# Altium schematic sheet DAC7828_Voltage-Reg-Ref.SchDoc
size A3; Organization: University of Amsterdam; Address1: Technology Centre; DocumentNumber: 1; SheetNumber: 2; SheetTotal: 4
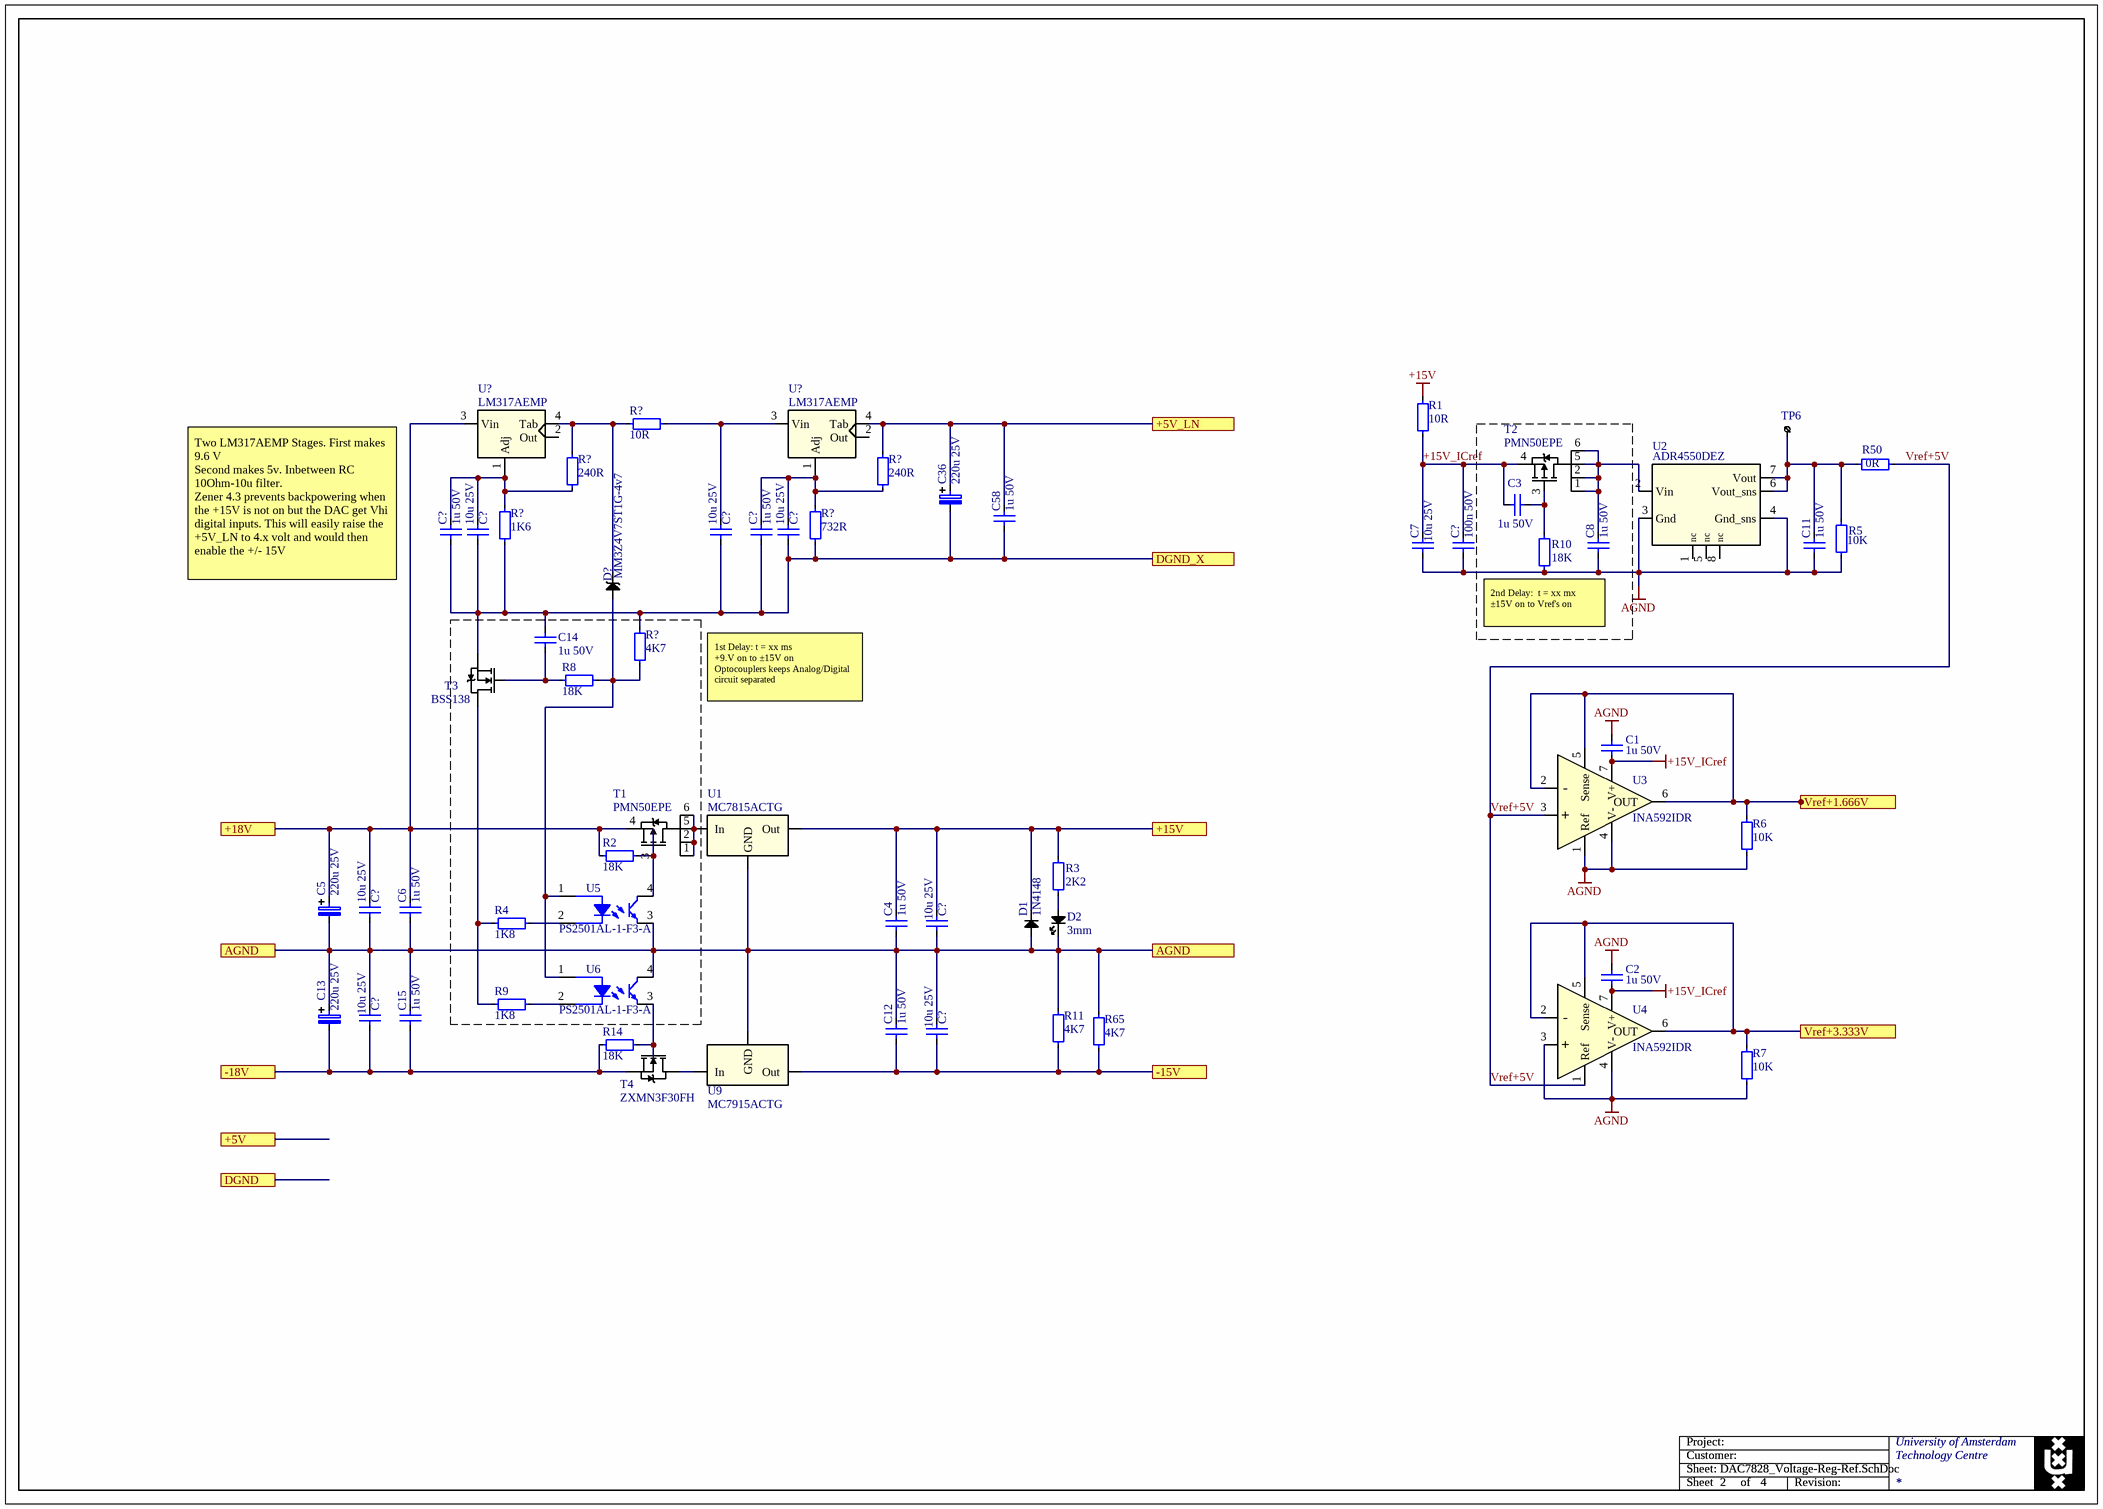
[diagram p0: DAC7828_Voltage-Reg-Ref.SchDoc]

## Parts
(Parts that share a designator on the sheet are numbered #1, #2 ... from top to bottom, then left to right.)
C1  1u 50V  [cap0603MD]
C2  1u 50V  [cap0603MD]
C3  1u 50V  [cap0603MD]
C4  1u 50V  [cap0603MD]
C5  220u 25V  [capAluSmd_d8H10mm]
C6  1u 50V  [cap0603MD]
C7  10u 25V  [cap0805MD]
C8  1u 50V  [cap0603MD]
C11  1u 50V  [cap0603MD]
C12  1u 50V  [cap0603MD]
C13  220u 25V  [capAluSmd_d8H10mm]
C14  1u 50V  [cap0603MD]
C15  1u 50V  [cap0603MD]
C36  220u 25V  [capAluSmd_d8H10mm]
C58  1u 50V  [cap0603MD]
C?#1  1u 50V  [cap0603MD]
C?#2  1u 50V  [cap0603MD]
C?#3  10u 25V  [cap0805MD]
C?#4  10u 25V  [cap0805MD]
C?#5  10u 25V  [cap0805MD]
C?#6  100n 50V  [cap0603MD]
C?#7  10u 25V  [cap0805MD]
C?#8  10u 25V  [cap0805MD]
C?#9  10u 25V  [cap0805MD]
C?#10  10u 25V  [cap0805MD]
D1  1N4148  [SOD2513X100N]
D2  3mm  [LED_3MM_PCB_EDGE_SMD]
D?  MM3Z4V7ST1G-4v7  [SOD-323-2]
R1  10R  [res0603MD]
R2  18K  [res0603MD]
R3  2K2  [res0603MD]
R4  1K8  [res0603MD]
R5  10K  [res0603MD]
R6  10K  [res0603MD]
R7  10K  [res0603MD]
R8  18K  [res0603MD]
R9  1K8  [res0603MD]
R10  18K  [res0603MD]
R11  4K7  [res0603MD]
R14  18K  [res0603MD]
R50  0R  [res0603MD]
R65  4K7  [res0603MD]
R?#1  10R  [res0603MD]
R?#2  240R  [res0603MD]
R?#3  240R  [res0603MD]
R?#4  1K6  [res0603MD]
R?#5  732R  [res0603MD]
R?#6  4K7  [res0603MD]
T1  PMN50EPE  [TSOP95P280X110-6N]
T2  PMN50EPE  [TSOP95P280X110-6N]
T3  BSS138  [SOT95P230X110-3N]
T4  ZXMN3F30FH  [SOT95P230X110-3N]
TP6  Testpoint  [Testpoint_1mm]  (value not drawn)  (no BOM)
U1  MC7815ACTG  [TO220-3_FLAT]
U2  ADR4550DEZ  [LCCS127P503X450X221-8M]
U3  INA592IDR  [SOIC127P600X175-8N]
U4  INA592IDR  [SOIC127P600X175-8N]
U5  PS2501AL-1-F3-A  [SOP254P960X380-4N]
U6  PS2501AL-1-F3-A  [SOP254P960X380-4N]
U9  MC7915ACTG  [TO220-3_FLAT]
U?#1  LM317AEMP  [SOT-223-3P]
U?#2  LM317AEMP  [SOT-223-3P]

## Ports
+5V, +5V_LN, +15V, +18V, -15V, -18V, AGND, DGND, DGND_X, Vref+1.666V, Vref+3.333V

## Nets
+15V: R1.2
+15V_ICref: C1.1 C2.1 C3.1 C7.2 C?#6.2 R1.1 T2.4(S) U3.7(V+) U4.7(V+)
AGND: C1.2 C2.2 C7.1 C8.2 C11.2 C?#6.1 R5.1 R6.1 R7.1 R10.1 U2.3(Gnd) U2.4(Gnd_sns) U3.1(Ref) U3.4(V-) U4.3(+) U4.4(V-)
+5V_LN: C36.P C58.1 R?#3.2 U?#2.4(Tab) ; port +5V_LN
+15V: C4.1 C?#8.2 D1.1 R3.2 U1.3(Out) ; port +15V  [a separate net that carries the same name]
+18V: C5.P C6.1 C?#7.2 R2.1 T1.4(S) U?#1.3(Vin) ; port +18V
-15V: C12.2 C?#10.1 R11.1 R65.1 U9.3(Out) ; port -15V
-18V: C13.N C15.2 C?#9.1 R14.1 T4.2(S) ; port -18V
AGND: C4.2 C5.N C6.2 C12.1 C13.P C15.1 C?#7.1 C?#8.1 C?#9.2 C?#10.2 D1.2 D2.1 R11.2 R65.2 U1.2(GND) U5.3 U6.4 U9.1(GND) ; port AGND  [a separate net that carries the same name]
DGND_X: C14.1 C36.N C58.2 C?#1.2 C?#2.2 C?#3.1 C?#4.1 C?#5.1 R?#4.1 R?#5.1 R?#6.2 T3.2(S) ; port DGND_X
Vref+1.666V: R6.2 U3.2(-) U3.5(Sense) U3.6(OUT) ; port Vref+1.666V
Vref+3.333V: R7.2 U4.2(-) U4.5(Sense) U4.6(OUT) ; port Vref+3.333V
Vref+5V: R50.2 U3.3(+) U4.1(Ref)
NetC3_2: C3.2 R10.2 T2.3(G)
NetC8_1: C8.1 T2.1(D) T2.2(D) T2.5(D) T2.6(D) U2.2(Vin)
NetC11_1: C11.1 R5.2 R50.1 TP6.1 U2.6(Vout_sns) U2.7(Vout)
NetC14_2: C14.2 R8.2 T3.1(G)
NetC?#1_1: C?#1.1 C?#3.2 R?#2.1 R?#4.2 U?#1.1(Adj)
NetC?#2_1: C?#2.1 C?#5.2 R?#3.1 R?#5.2 U?#2.1(Adj)
NetC?#4_2: C?#4.2 R?#1.2 U?#2.3(Vin)
NetD2_2: D2.2 R3.1
NetD?_A: D?.A R8.1 R?#6.1 U5.1 U6.1
NetD?_C: D?.C R?#1.1 R?#2.2 U?#1.4(Tab)
NetR2_2: R2.2 T1.3(G) U5.4
NetR4_1: R4.1 R9.1 T3.3(D)
NetR4_2: R4.2 U5.2
NetR9_2: R9.2 U6.2
NetR14_2: R14.2 T4.1(G) U6.3
NetT1_1: T1.1(D) T1.2(D) T1.5(D) T1.6(D) U1.1(In)
NetT4_3: T4.3(D) U9.2(In)

Not connected (* = marked no-connect by the designer): U2 1(nc) 5(nc) 8(nc); U?#1 2(Out); U?#2 2(Out)

## Notes on the sheet
- Two LM317AEMP Stages. First makes 9.6 V
  Second makes 5v. Inbetween RC 10Ohm-10u filter.
  Zener 4.3 prevents backpowering when the +15V is not on but the DAC get Vhi digital inputs. This will easily raise the +5V_LN to 4.x volt and would then enable the +/- 15V
- (near R10) 2nd Delay:  t = xx mx
  ±15V on to Vref's on
- 1st Delay: t = xx ms
  +9.V on to ±15V on
  Optocouplers keeps Analog/Digital circuit separated
- Project:
- Customer:
- Sheet
- Sheet:
- of
- Revision:

## Library data of the parts
C1-C4 C6 C8 C11 C12 C14 C15 C58 C?#1 C?#2 = Cap0603MD_1u_X5R_50V_10%: id: 123; Precision: 10%; Type: X5R; Author: Twe; Partname: Cap0603MD_1u_X5R_50V_10%; MyComment: 1u 50V; Capacitance: 1u; Supplier 1: Farnell; Supplier Part Number 1: 3013383; CreationDate: 23-Mar-20; Checked by: Unchecked; Voltage: 50V
C5 C13 C36 = EDK227M025A9MAA: Cap Alu SMD d8h11, ±20%; Manufacturer: Kemet; id: 37; Author: EB; Partname: EDK227M025A9MAA; MyComment: 220u 25V; Capacitance: 220u; Precision: 20%; ManufacturerCode: EDK227M025A9MAA; Supplier 1: Digi-Key; Supplier Part Number 1: 399-18129-1-ND; CreationDate: 06-Jul-22 14:38:19; Checked by: Unchecked; Voltage: 25V
C7 C?#3-C?#5 C?#7-C?#10 = Cap0805MD_10u_X5R_25V_10%: id: 146; Precision: 10%; Type: 5XR; Author: EB; Partname: Cap0805MD_10u_X5R_25V_10%; MyComment: 10u 25V; Capacitance: 10u; Supplier 1: Farnell; Supplier Part Number 1: 1735530; CreationDate: 31-Mar-16 14:12:18; Checked by: Unchecked; Voltage: 25V
C?#6 = Cap0603MD_100n_X7R_50V_10%: id: 12; Precision: 10%; Type: X7R; Author: TvR; Partname: Cap0603MD_100n_X7R_50V_10%; MyComment: 100n 50V; Capacitance: 100n; Supplier 1: Farnell; Supplier Part Number 1: 2581046; CreationDate: 31-Mar-16 14:01:33; Checked by: Unchecked; Voltage: 50V
D1 = 1N4148WS: Small Signal Diode, Single, 100 V, 150 mA, 1 V, 4 ns, 350 mA; Manufacturer: Multicomp; id: 15; Type: General Purpose; Author: Twe; Partname: 1N4148WS; MyComment: 1N4148; ManufacturerCode: 1N4148WS; Supplier 1: Farnell; Supplier Part Number 1: 1466524; CreationDate: 26-Aug-16 13:43:40; Checked by: PCB
D2 = LED_3mm_PcbEdgeSmd: Generic 3mm LED Footprint PCB Edge SMD Pads; id: 40; Author: EB; Partname: LED_3mm_PcbEdgeSmd; MyComment: 3mm; Type: LED; Supplier 1: Farnell; CreationDate: 26-May-16 08:35:38; Checked by: Unchecked
D? = MM3Z4V7ST1G: Zener 4v7, 300 mW, SOD−323; Manufacturer: On Semiconductor; id: 41; Author: EB; Partname: MM3Z4V7ST1G; MyComment: MM3Z4V7ST1G-4v7; Type: Zener; ManufacturerCode: MM3Z4V7ST1G; Supplier 1: Farnell; Supplier Part Number 1: 2463512; CreationDate: 13-Oct-22 10:49:01; Checked by: Unchecked
R1 R?#1 = Res0603MD_10R_1%: id: 265; Precision: 1%; Author: Twe; Partname: Res0603MD_10R_1%; MyComment: 10R; Resistance: 10R; Supplier 1: Farnell; Supplier Part Number 1: 2447233; CreationDate: 30-Mar-16 10:33:13; Checked by: Unchecked
R2 R8 R10 R14 = Res0603MD_18K_1%: id: 342; Precision: 1%; Author: Twe; Partname: Res0603MD_18K_1%; MyComment: 18K; Resistance: 18K; Supplier 1: Farnell; Supplier Part Number 1: 9330720; CreationDate: 30-Mar-16 10:33:13; Checked by: Unchecked
R3 = Res0603MD_2K2_1%: id: 320; Precision: 1%; Author: Twe; Partname: Res0603MD_2K2_1%; MyComment: 2K2; Resistance: 2K2; Supplier 1: Farnell; Supplier Part Number 1: 9330810; CreationDate: 30-Mar-16 10:33:13; Checked by: Unchecked
R4 R9 = Res0603MD_1K8_1%: id: 318; Precision: 1%; Author: Twe; Partname: Res0603MD_1K8_1%; MyComment: 1K8; Resistance: 1K8; Supplier 1: Farnell; Supplier Part Number 1: 9330712; CreationDate: 30-Mar-16 10:33:13; Checked by: Unchecked
R5-R7 = Res0603MD_10K_1%: id: 336; Precision: 1%; Author: TvR; Partname: Res0603MD_10K_1%; MyComment: 10K; Resistance: 10K; Supplier 1: Farnell; Supplier Part Number 1: 2446547; CreationDate: 30-Mar-16 10:33:13; Checked by: Unchecked
R11 R65 R?#6 = Res0603MD_4K7_1%: id: 328; Precision: 1%; Author: Twe; Partname: Res0603MD_4K7_1%; MyComment: 4K7; Resistance: 4K7; Supplier 1: Farnell; Supplier Part Number 1: 2447385; CreationDate: 30-Mar-16 10:33:13; Checked by: Unchecked
R50 = Res0603MD_0R_1%: id: 264; Precision: 1%; Author: Twe; Partname: Res0603MD_0R_1%; MyComment: 0R; Resistance: 0R; Supplier 1: Farnell; Supplier Part Number 1: 2447743; CreationDate: 30-Mar-16 10:33:13; Checked by: Unchecked
R?#2 R?#3 = Res0603MD_240R_1%: id: 297; Precision: 1%; Author: Twe; Partname: Res0603MD_240R_1%; MyComment: 240R; Resistance: 240R; Supplier 1: Farnell; Supplier Part Number 1: 9330860; CreationDate: 30-Mar-16 10:33:13; Checked by: Unchecked
R?#4 = Res0603MD_1K6_1%: id: 317; Precision: 1%; Author: Twe; Partname: Res0603MD_1K6_1%; MyComment: 1K6; Resistance: 1K6; Supplier 1: Farnell; Supplier Part Number 1: 9330666; CreationDate: 30-Mar-16 10:33:13; Checked by: Unchecked
R?#5 = Res0603MD_7320R_1%: id: 537; Precision: 1%; Author: Twe; Partname: Res0603MD_7320R_1%; MyComment: 732R; Resistance: 732R; Supplier 1: Farnell; Supplier Part Number 1: 9331506; CreationDate: 30-Mar-16 10:33:13; Checked by: Unchecked
T1 T2 = PMN50EPE: P Channel, MOSFET, -30 V, -6A, 0.045 ohm, SOT457; Manufacturer: NEXPERIA; id: 27; Type: MOSFET P; Author: EB; Partname: PMN50EPE; MyComment: PMN50EPE; ManufacturerCode: PMN50EPE; Supplier 1: Farnell; Supplier Part Number 1: 2900296; CreationDate: 08-Jul-22 12:04:36; Checked by: Unchecked
T3 = BSS138: N-Channel Logic Level Enhancement, 3R5; Manufacturer: ON Semi; id: 20; Type: MOSFET EN; Author: TvR; Partname: BSS138; MyComment: BSS138; ManufacturerCode: BSS138; Supplier 1: Farnell; Supplier Part Number 1: 9845330; CreationDate: 20-May-19 16:27:00; Checked by: Unchecked
T4 = ZXMN3F30FH: MOSFET Transistor, N Channel, 4.6 A, 30 V, 65 mohm, 4.5Vgs; Manufacturer: ZETEX; id: 26; Type: MOSFET N; Author: EB; Partname: ZXMN3F30FH; MyComment: ZXMN3F30FH; ManufacturerCode: ZXMN3F30FH; Supplier 1: Farnell; Supplier Part Number 1: 1583667; CreationDate: 07-Jul-22 12:16:34; Checked by: Unchecked
TP6 = Testpoint_1mm: Testpoint pad 1mm; id: 2; Author: Twe; Partname: Testpoint_1mm; MyComment: Testpoint; Type: Testpoint; Supplier 1: Farnell; CreationDate: 31-Mar-16 13:33:27; Checked by: PCB
U1 = MC7815ACTG_Flat: Linear Voltage Regulator,Positive, Fixed, 35V In, 15V And 1A Out; Manufacturer: OnSEMI; id: 191; Author: EB; Partname: MC7815ACTG_Flat; MyComment: MC7815ACTG; Type: Power; ManufacturerCode: MC7815ACTG; Supplier 1: Digi-Key; CreationDate: 06-Jul-22 13:15:49; Checked by: Unchecked
U2 = ADR4550DEZ: Ultralow Noise, High Accuracy / Voltage References; Manufacturer: Analog Devices; id: 187; Author: EB; Partname: ADR4550DEZ; MyComment: ADR4550DEZ; Type: Voltage Reference; ManufacturerCode: ADR4550DEZ; Supplier 1: Digi-Key; Supplier Part Number 1: 505-ADR4550DEZ-ND; CreationDate: 04-Jul-22 15:46:48; Checked by: Unchecked
U3 U4 = INA592IDR: INA592 High-Precision, Wide-Bandwidth e-trim™ Difference Amplifier; Manufacturer: Texas Instruments; id: 186; Partname: INA592IDR; MyComment: INA592IDR; Type: Opamp; ManufacturerCode: INA592IDR; Supplier 1: Digi-Key; Supplier Part Number 1: 296-INA592IDRCT-ND; Author: EB; CreationDate: 04-Jul-22 14:48:50; Checked by: Unchecked
U5 U6 = PS2501AL-1-F3-A: Optocoupler 1ch, Vceo=70V, Ic=30mA, CTR=200-400% @ 5mA; Manufacturer: CEL; id: 28; Partname: PS2501AL-1-F3-A; MyComment: PS2501AL-1-F3-A; Type: OptoCoupler; ManufacturerCode: PS2501AL-1-F3-A; Supplier 1: Farnell; Supplier Part Number 1: 3605298; Author: EB; CreationDate: 11-Jul-22 09:21:13; Checked by: Unchecked
U9 = MC7915ACTG_Flat: Linear Voltage Regulator,Negative, Fixed, -35V In, -15V And -1A Out; Manufacturer: OnSEMI; id: 192; Author: EB; Partname: MC7915ACTG_Flat; MyComment: MC7915ACTG; Type: Power; ManufacturerCode: MC7915ACTG; Supplier 1: Digi-Key; CreationDate: 06-Jul-22 13:25:15; Checked by: Unchecked
U?#1 U?#2 = LM317AEMP: LM317A 1% Accurate 1.5A Adjustable Voltage Regulator 1.25-37V; Manufacturer: Texas Instruments; ManufacturerCode: LM371AEMP; id: 199; Author: EB; Partname: LM317AEMP; MyComment: LM317AEMP; Type: Voltage Regulator; Supplier 1: Mouser; Supplier Part Number 1: 926-LM317AEMP/NOPB; CreationDate: 06-Aug-21 14:07:49; Checked by: Unchecked